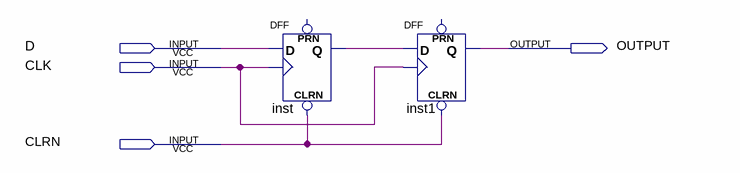
[diagram p0: schematic sheet]
// Quartus schematic FF_META.bdf as structural Verilog: 2 symbols, 4 pins
module FF_META (
  input  D,
  input  CLK,
  input  CLRN,
  output OUTPUT
);

  wire inst_q;

  DFF inst (.CLRN(CLRN), .CLK(CLK), .D(D), .Q(inst_q));  // open: PRN
  DFF inst1 (.CLRN(CLRN), .CLK(CLK), .D(inst_q), .Q(OUTPUT));  // open: PRN
endmodule
